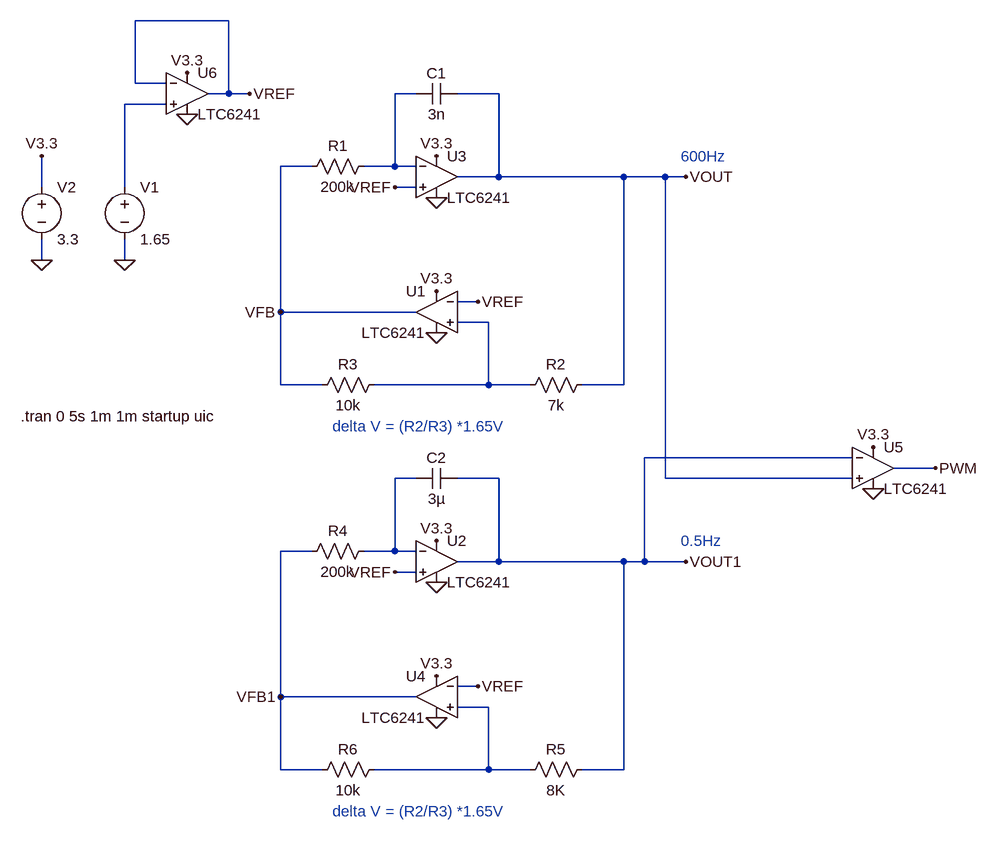
[diagram p0: schematic LEDIndicatorBridge.asc]
LEDIndicatorBridge.asc, the LTspice schematic file:
Version 4
SHEET 1 1148 1024
WIRE -16 -208 -160 -208
WIRE -160 -112 -160 -208
WIRE -112 -112 -160 -112
WIRE -16 -96 -16 -208
WIRE -16 -96 -48 -96
WIRE 16 -96 -16 -96
WIRE 272 -96 240 -96
WIRE 400 -96 336 -96
WIRE -112 -80 -176 -80
WIRE 112 16 64 16
WIRE 240 16 240 -96
WIRE 240 16 192 16
WIRE 272 16 240 16
WIRE 400 32 400 -96
WIRE 400 32 336 32
WIRE 592 32 400 32
WIRE 656 32 592 32
WIRE 688 32 656 32
WIRE -304 48 -304 0
WIRE -176 48 -176 -80
WIRE 272 48 240 48
WIRE -304 160 -304 128
WIRE -176 160 -176 128
WIRE 368 224 336 224
WIRE 64 240 64 16
WIRE 272 240 64 240
WIRE 384 256 336 256
WIRE 64 352 64 240
WIRE 128 352 64 352
WIRE 384 352 384 256
WIRE 384 352 208 352
WIRE 448 352 384 352
WIRE 592 352 592 32
WIRE 592 352 528 352
WIRE 944 464 624 464
WIRE 1072 480 1008 480
WIRE 272 496 240 496
WIRE 400 496 336 496
WIRE 656 496 656 32
WIRE 944 496 656 496
WIRE 112 608 64 608
WIRE 240 608 240 496
WIRE 240 608 192 608
WIRE 272 608 240 608
WIRE 400 624 400 496
WIRE 400 624 336 624
WIRE 592 624 400 624
WIRE 624 624 624 464
WIRE 624 624 592 624
WIRE 688 624 624 624
WIRE 272 640 240 640
WIRE 368 816 336 816
WIRE 64 832 64 608
WIRE 272 832 64 832
WIRE 384 848 336 848
WIRE 64 944 64 832
WIRE 128 944 64 944
WIRE 384 944 384 848
WIRE 384 944 208 944
WIRE 448 944 384 944
WIRE 592 944 592 624
WIRE 592 944 528 944
FLAG 304 0 V3.3
FLAG 304 208 V3.3
FLAG 304 64 0
FLAG 304 272 0
FLAG -176 160 0
FLAG -304 160 0
FLAG -304 0 V3.3
FLAG 240 48 VREF
FLAG 368 224 VREF
FLAG 688 32 VOUT
FLAG 64 240 VFB
FLAG 304 592 V3.3
FLAG 304 800 V3.3
FLAG 304 656 0
FLAG 304 864 0
FLAG 240 640 VREF
FLAG 368 816 VREF
FLAG 688 624 VOUT1
FLAG 64 832 VFB1
FLAG 976 448 V3.3
FLAG 976 512 0
FLAG 1072 480 PWM
FLAG -80 -128 V3.3
FLAG -80 -64 0
FLAG 16 -96 VREF
SYMBOL res 208 0 R90
WINDOW 0 0 56 VBottom 2
WINDOW 3 32 56 VTop 2
SYMATTR InstName R1
SYMATTR Value 200k
SYMBOL cap 336 -112 R90
WINDOW 0 0 32 VBottom 2
WINDOW 3 32 32 VTop 2
SYMATTR InstName C1
SYMATTR Value 3n
SYMBOL res 544 336 R90
WINDOW 0 0 56 VBottom 2
WINDOW 3 32 56 VTop 2
SYMATTR InstName R2
SYMATTR Value 7k
SYMBOL res 224 336 R90
WINDOW 0 0 56 VBottom 2
WINDOW 3 32 56 VTop 2
SYMATTR InstName R3
SYMATTR Value 10k
SYMBOL voltage -176 32 R0
SYMATTR InstName V1
SYMATTR Value 1.65
SYMBOL voltage -304 32 R0
SYMATTR InstName V2
SYMATTR Value 3.3
SYMBOL Opamps\\LTC6241 304 32 R0
SYMATTR InstName U3
SYMBOL Opamps\\LTC6241 304 240 M0
SYMATTR InstName U1
SYMBOL res 208 592 R90
WINDOW 0 0 56 VBottom 2
WINDOW 3 32 56 VTop 2
SYMATTR InstName R4
SYMATTR Value 200k
SYMBOL cap 336 480 R90
WINDOW 0 0 32 VBottom 2
WINDOW 3 32 32 VTop 2
SYMATTR InstName C2
SYMATTR Value 3µ
SYMBOL res 544 928 R90
WINDOW 0 0 56 VBottom 2
WINDOW 3 32 56 VTop 2
SYMATTR InstName R5
SYMATTR Value 8K
SYMBOL res 224 928 R90
WINDOW 0 0 56 VBottom 2
WINDOW 3 32 56 VTop 2
SYMATTR InstName R6
SYMATTR Value 10k
SYMBOL Opamps\\LTC6241 304 624 R0
SYMATTR InstName U2
SYMBOL Opamps\\LTC6241 304 832 M0
SYMATTR InstName U4
SYMBOL Opamps\\LTC6241 976 480 R0
SYMATTR InstName U5
SYMBOL Opamps\\LTC6241 -80 -96 R0
SYMATTR InstName U6
TEXT -336 400 Left 2 !.tran 0 5s 1m 1m startup uic
TEXT 144 416 Left 2 ;delta V = (R2/R3) *1.65V
TEXT 680 0 Left 2 ;600Hz
TEXT 144 1008 Left 2 ;delta V = (R2/R3) *1.65V
TEXT 680 592 Left 2 ;0.5Hz

The netlist it stands for:
* LEDIndicatorBridge.asc
R1 N001 VFB 200k
C1 VOUT N001 3n
R2 VOUT N003 7k
R3 N003 VFB 10k
V1 N002 0 1.65
V2 V3.3 0 3.3
XU3 VREF N001 V3.3 0 VOUT LTC6241  ; pins In+ In- V+ V- OUT
XU1 N003 VREF V3.3 0 VFB LTC6241  ; pins In+ In- V+ V- OUT
R4 N004 VFB1 200k
C2 VOUT1 N004 3µ
R5 VOUT1 N005 8K
R6 N005 VFB1 10k
XU2 VREF N004 V3.3 0 VOUT1 LTC6241  ; pins In+ In- V+ V- OUT
XU4 N005 VREF V3.3 0 VFB1 LTC6241  ; pins In+ In- V+ V- OUT
XU5 VOUT VOUT1 V3.3 0 PWM LTC6241  ; pins In+ In- V+ V- OUT
XU6 N002 VREF V3.3 0 VREF LTC6241  ; pins In+ In- V+ V- OUT
.tran 0 5s 1m 1m startup uic
* delta V = (R2/R3) *1.65V
* 600Hz
* delta V = (R2/R3) *1.65V
* 0.5Hz
.lib LTC4.lib
.backanno
.end